# Altium schematic sheet rfid.SchDoc
size A4
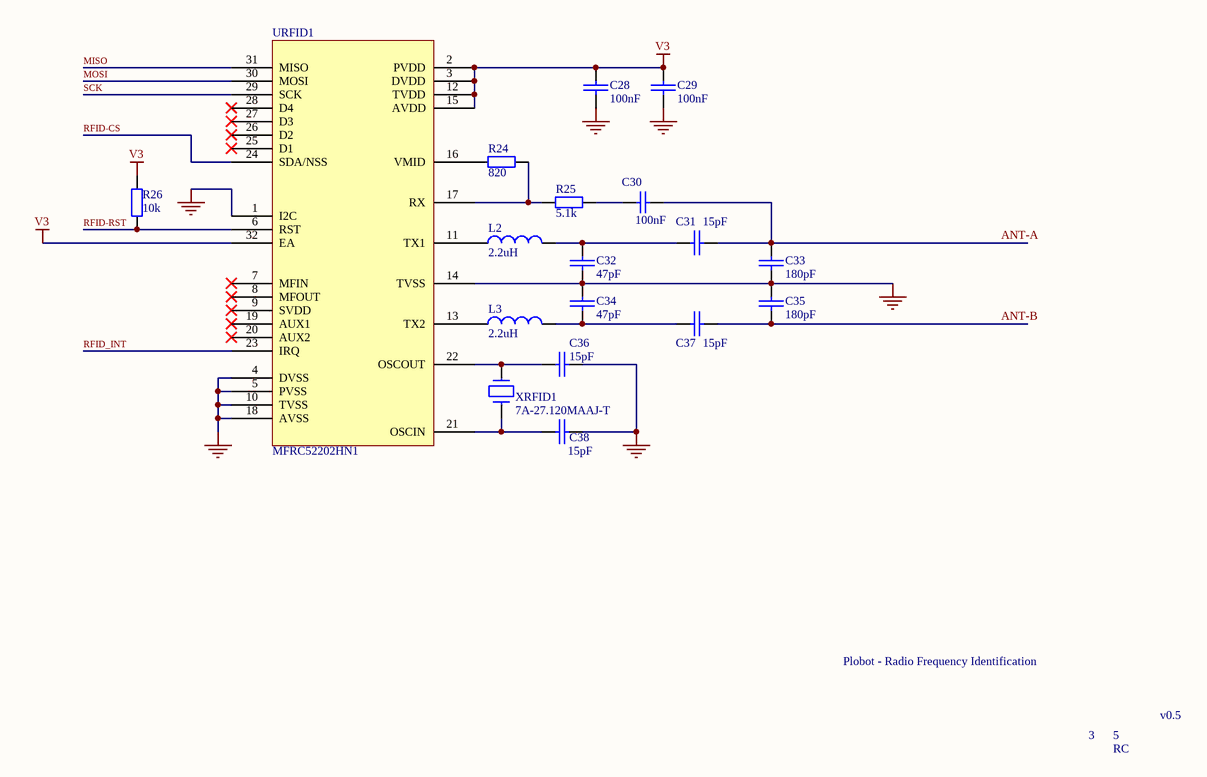
[diagram p0: rfid.SchDoc]

## Parts
C28  100nF  [CAPC1608N]
C29  100nF  [CAPC1608N]
C30  100nF  [CAPC1608N]
C31  15pF  [CAPC1608N]
C32  47pF  [CAPC1608N]
C33  180pF  [CAPC1608N]
C34  47pF  [CAPC1608N]
C35  180pF  [CAPC1608N]
C36  15pF  [CAPC1608N]
C37  15pF  [CAPC1608N]
C38  15pF  [CAPC1608N]
L2  2.2uH  [INDC1608N]
L3  2.2uH  [INDC1608N]
R24  820  [RESC1608N]
R25  5.1k  [RESC1608N]
R26  10k  [RESC1608N]
URFID1  MFRC52202HN1  [MFRC52202HN1]
XRFID1  7A-27.120MAAJ-T  [XTAL]

## Nets
GND: C28.1 C29.1 C32.1 C33.1 C34.2 C35.2 C36.2 C38.2 URFID1.1(I2C) URFID1.4(DVSS) URFID1.5(PVSS) URFID1.10(TVSS) URFID1.14(TVSS) URFID1.18(AVSS)
V3: C28.2 C29.2 R26.1 URFID1.2(PVDD) URFID1.3(DVDD) URFID1.12(TVDD) URFID1.15(AVDD) URFID1.32(EA)
ANT-A: C30.2 C31.2 C33.2
ANT-B: C35.1 C37.2
MISO: URFID1.31(MISO)
MOSI: URFID1.30(MOSI)
RFID-CS: URFID1.24(SDA/NSS)
RFID-RST: R26.2 URFID1.6(RST)
RFID_INT: URFID1.23(IRQ)
SCK: URFID1.29(SCK)
NetC30_1: C30.1 R25.1
NetC31_1: C31.1 C32.2 L2.2
NetC34_1: C34.1 C37.1 L3.2
NetC36_1: C36.1 URFID1.22(OSCOUT) XRFID1.2
NetC38_1: C38.1 URFID1.21(OSCIN) XRFID1.1
NetL2_1: L2.1 URFID1.11(TX1)
NetL3_1: L3.1 URFID1.13(TX2)
NetR24_1: R24.1 R25.2 URFID1.17(RX)
NetR24_2: R24.2 URFID1.16(VMID)

Not connected (* = marked no-connect by the designer): URFID1 7(MFIN)* 8(MFOUT)* 9(SVDD)* 19(AUX1)* 20(AUX2)* 25(D1)* 26(D2)* 27(D3)* 28(D4)*

## Notes on the sheet
- Plobot - Radio Frequency Identification
- 3
- 5
- v0.5
- RC

## Library data of the parts
C28-C38 = Cap: Capacitor
  C30: Published: 8-Jun-2000; LatestRevisionDate: 17-Jul-2002; LatestRevisionNote: Re-released for DXP Platform.; PackageReference: RAD-0.3; Publisher: Altium Limited; PackageDescription: Radial Cap, Thru-Hole; 2 Leads; 0.3 in Pin Spacing; Value: 100nF
L2 L3 = Inductor: Code_IEC: 1005; Published: 8-Jun-2000; LatestRevisionDate: 29-May-2009; LatestRevisionNote: IPC-7351 Footprint Added.; PackageReference: 0402-A; Publisher: Altium Limited; PackageDescription: Chip Inductor; Code_JEITA: 0402; Value: 2.2uH
R24-R26 = Res2: Resistor; Published: 8-Jun-2000; LatestRevisionDate: 17-Jul-2002; LatestRevisionNote: Re-released for DXP Platform.; PackageReference: AXIAL-0.4; Publisher: Altium Limited
  R24: Value: 820
  R25: Value: 5.1k
  R26: Value: 10k
XRFID1 = Tm08B.S01_12M_42